# Altium project DATN_Project.PrjPcb
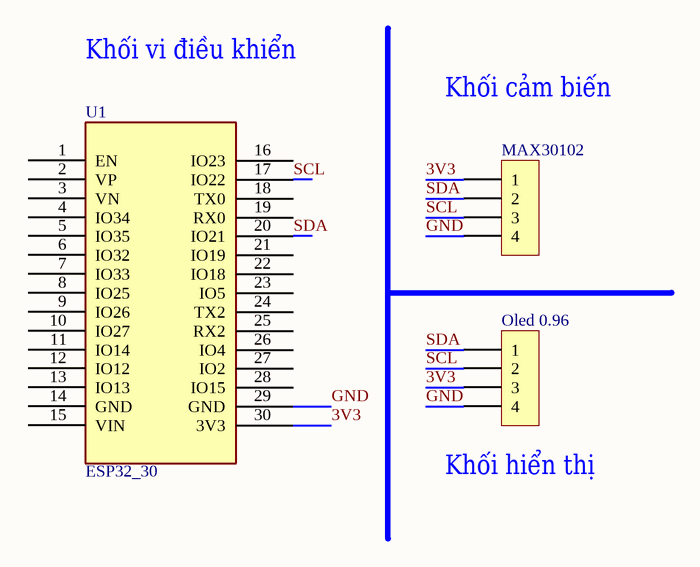
[diagram p0: DATN.SchDoc]
1 sheet, 3 parts. Net scope: global (net labels, ports and power ports of the same name join across sheets).
Board file: DATN.PcbDoc

## Sheet DATN.SchDoc
size A; SheetNumber: 1; SheetTotal: 1

### Parts
MAX30102  Header 4P 2.54 Duc Thang  [XH2.54M-4]  (value not drawn)
Oled_0.96  Header 4P 2.54 Duc Thang  [XH2.54M-4]  (value not drawn)
U1  ESP32_30  [ESP32_30]

### Nets
3V3: MAX30102.1 Oled_0.96.3 U1.30(3V3)
GND: MAX30102.4 Oled_0.96.4 U1.29(GND)
SCL: MAX30102.3 Oled_0.96.2 U1.17(IO22)
SDA: MAX30102.2 Oled_0.96.1 U1.20(IO21)

Not connected (* = marked no-connect by the designer): U1 1(EN) 2(VP) 3(VN) 4(IO34) 5(IO35) 6(IO32) 7(IO33) 8(IO25) 9(IO26) 10(IO27) 11(IO14) 12(IO12) 13(IO13) 14(GND) 15(VIN) 16(IO23) 18(TX0) 19(RX0) 21(IO19) 22(IO18) 23(IO5) 24(TX2) 25(RX2) 26(IO4) 27(IO2) 28(IO15)

### Notes on the sheet
- Khối vi điều khiển
- Khối cảm biến
- (near Oled_0.96) Khối hiển thị

### Library data of the parts
MAX30102 Oled_0.96 = Header 4P 2.54 Duc Thang: Cắm; Ten_Linh_Kien: Header 4P XH2.54-4P Đực Thẳng; Don_Vi: Con; Ma_Hang: MH001285; Chung_Loai: Cắm
U1 = ESP32_30: Microcontoller Board 30 Pins Wifi 2.4GHz BLE 4.2 ESP32-WROOM-32D; ComponentLink1Description: Datasheet; ComponentLink1URL: https://www.mouser.com/datasheet/2/891/esp32_wroom_32d_esp32_wroom_32u_datasheet_en-1365844.pdf